# Altium schematic sheet Motor Driver.SchDoc: Motherboard-Motor Driver
size A4; Author: Patryk Bujak; DrawnBy: Patryk Bujak; DocumentNumber: 12; Revision: 1.0; SheetNumber: 6; SheetTotal: 10
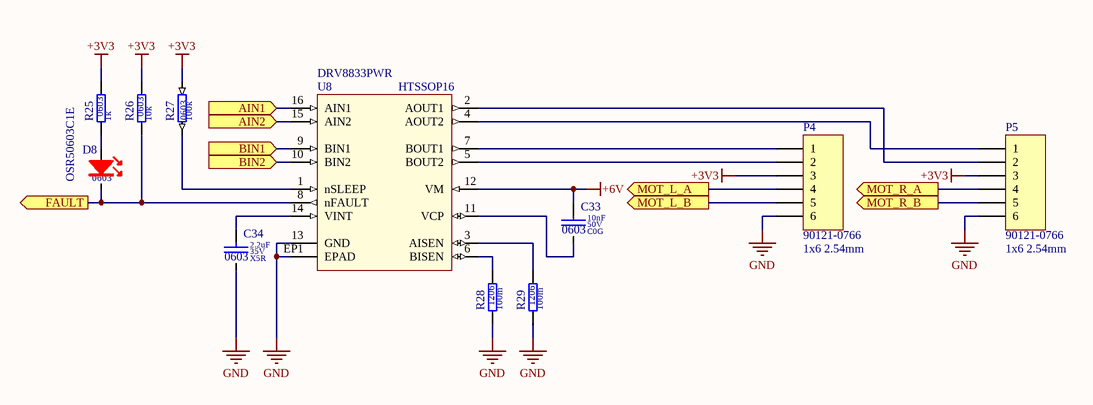
[diagram p0: Motor Driver.SchDoc]

## Parts
C33  value 10nF  Dielectric: C0G  Voltage: 50V  SCH_Footprint: 0603  [C_0603_1608]  (hidden comment: Ceramic C0G)
C34  value 2.2uF  Dielectric: X5R  Voltage: 35V  SCH_Footprint: 0603  [C_0603_1608]  (hidden comment: Ceramic X5R)
D8  value OSR50603C1E  SCH_Footprint: 0603  [OL_0603_1608]  (hidden comment: Red led)
P4  value 90121-0766  SCH_Footprint: 1x6 2.54mm  [P_HEADER_1x6_2.54_ANGLE]  (hidden comment: Goldpin)
P5  value 90121-0766  SCH_Footprint: 1x6 2.54mm  [P_HEADER_1x6_2.54_ANGLE]  (hidden comment: Goldpin)
R25  value 1k  SCH_Footprint: 0603  [R_0603_1608]  (hidden comment: Resistor)
R26  value 10k  SCH_Footprint: 0603  [R_0603_1608]  (hidden comment: Resistor)
R27  value 100k  SCH_Footprint: 0603  [R_0603_1608]  (hidden comment: Resistor)
R28  value 100m  SCH_Footprint: 1206  [R_1206_3216]  (hidden comment: Resistor)
R29  value 100m  SCH_Footprint: 1206  [R_1206_3216]  (hidden comment: Resistor)
U8  value DRV8833PWR  SCH_Footprint: HTSSOP16  [HTSSOP16_45x66x20_M]  (hidden comment: 2A Low Voltage Dual Brushed DC or Single Bipolar Stepper Motor Driver (PWM Ctrl))

## Ports
AIN1 (in), AIN2 (in), BIN1 (in), BIN2 (in), FAULT (out), MOT_L_A (out), MOT_L_B (out), MOT_R_A (out), MOT_R_B (out)

## Nets
+3V3: P4.3 P5.3 R25.2 R26.2 R27.1
+6V: C33.1 U8.12(VM)
GND: C34.2 P4.6 P5.6 R28.1 R29.1 U8.13(GND) U8.EP1(EPAD)
AIN1: U8.16(AIN1) ; port AIN1
AIN2: U8.15(AIN2) ; port AIN2
BIN1: U8.9(BIN1) ; port BIN1
BIN2: U8.10(BIN2) ; port BIN2
FAULT: D8.1(K) R26.1 U8.8(nFAULT) ; port FAULT
MOT_L_A: P4.4 ; port MOT_L_A
MOT_L_B: P4.5 ; port MOT_L_B
MOT_R_A: P5.4 ; port MOT_R_A
MOT_R_B: P5.5 ; port MOT_R_B
NetC33_2: C33.2 U8.11(VCP)
NetC34_1: C34.1 U8.14(VINT)
NetD8_2: D8.2(A) R25.1
NetP4_1: P4.1 U8.7(BOUT1)
NetP4_2: P4.2 U8.5(BOUT2)
NetP5_1: P5.1 U8.4(AOUT2)
NetP5_2: P5.2 U8.2(AOUT1)
NetR27_2: R27.2 U8.1(nSLEEP)
NetR28_2: R28.2 U8.6(BISEN)
NetR29_2: R29.2 U8.3(AISEN)

## Notes on the sheet
- Title:
- Sheet:
- of
- Author:
- Model:
- Document Number:
- Checked by:
- Iss-Rev:
- Approved by:
- Date:
- File name:

## Library data of the parts
C33 = C_10nF_50V_C0G_0603_5: Capacitor; Manufacturer: Murata; Manufacturer Part Number: GRM1885C1H103JA01D; Tolerance (%): 5; Part Number: C_10nF_50V_C0G_0603_5; HelpURL: https://datasheet.octopart.com/GRM1885C1H103JA01D-Murata-datasheet-34231350.pdf; Supplier 1: TME; Supplier Part Number 1: GRM1885C1H103JA01D; Supplier 2: RS Components; Supplier Part Number 2: 144-9032; Supplier 3: Farnell; Supplier Part Number 3: 2456107; Supplier 4: Mouser; Supplier Part Number 4: 81-GRM1885C1H103JA1D; Supplier 5: Digi-Key; Supplier Part Number 5: 490-9666-1-ND
C34 = C_2.2uF_35V_X5R_0603_10: Capacitor; Manufacturer: Murata; Manufacturer Part Number: GRM188R6YA225KA12D; Tolerance (%): 10; Part Number: C_2.2uF_35V_X5R_0603_10; HelpURL: https://datasheet.octopart.com/GRM188R6YA225KA12D-Murata-datasheet-66077095.pdf; Supplier 1: TME; Supplier 2: RS Components; Supplier Part Number 2: 8151358; Supplier 3: Farnell; Supplier Part Number 3: 2611926; Supplier 4: Mouser; Supplier Part Number 4: 81-GRM188R6YA225KA2D; Supplier 5: Digi-Key; Supplier Part Number 5: 490-7204-1-ND
D8 = OL_R_0603_OSR50603C1E: LED_RED; Manufacturer: Optosupply; Part Number: OL_R_0603_OSR50603C1E; Manufacturer Part Number: OSR50603C1E; Supplier 1: TME; Supplier Part Number 1: OSR50603C1E; Supplier 2: RS Components; Supplier 3: Farnell; Supplier 4: Mouser; Supplier 5: Digi-Key
P4 P5 = P_HEADER_1x6_2.54_ANGLE: Header, 6-Pin; Manufacturer: Molex; Part Number: P_HEADER_1x6_2.54_ANGLE; Component Type: Standard; HelpURL: https://datasheet.octopart.com/901210766-Molex-datasheet-8335778.pdf; Manufacturer Part Number: 90121-0766; Supplier 1: TME; Supplier Part Number 1: 90121-0766; Supplier 2: RS Components; Supplier Part Number 2: 3606415; Supplier 3: Farnell; Supplier Part Number 3: 9733477; Supplier 4: Mouser; Supplier Part Number 4: 538-90121-0766; Supplier 5: Digi-Key; Supplier Part Number 5: WM8112-ND
R25 = R_1k_0603_1: Manufacturer: Vishay; Manufacturer Part Number: CRCW06031K00FKEA; Voltage: 75V; Power: 100mW; Tolerance: 1%; Part Number: R_1k_0603_1; HelpURL: http://www.farnell.com/datasheets/2310790.pdf?_ga=2.256888843.1690599162.1548417389-1379097396.1542296996&_gac=1.262631934.1547230258.Cj0KCQiAmuHhBRD0ARIsAFWyPwhX8HcvXnM3tA0ZBodZLzDIjH2ZxLpjT5LWo9bad_HPRbU8LfPq44UaAhEwEALw_wcB; Supplier 1: TME; Supplier 2: RS Components; Supplier Part Number 2: 678-9875P; Supplier 3: Farnell; Supplier Part Number 3: 1469740; Supplier 4: Mouser; Supplier Part Number 4: 71-CRCW0603-1.0K-E3; Supplier 5: Digi-Key; Supplier Part Number 5: 541-1.00KHCT-ND
R26 = R_10k_0603_1: Manufacturer: Vishay; Manufacturer Part Number: CRCW060310K0FKTABC; Voltage: 75V; Power: 100mW; Tolerance: 1%; Part Number: R_10k_0603_1; HelpURL: http://www.tme.eu/pl/Document/622e28308c06d160637f2b14751ba16b/Data%20Sheet%20CRCW_BCe3.pdf; Supplier 1: TME; Supplier Part Number 1: CRCW060310K0FKTABC; Supplier 2: RS Components; Supplier 3: Farnell; Supplier 4: Mouser; Supplier Part Number 4: 667-ERJ-3EKF1002V; Supplier 5: Digi-Key; Supplier Part Number 5: P10KGCT-ND
R27 = R_100k_0603_1: Manufacturer: Royalohm; Manufacturer Part Number: 0603SAF1003T5E; Voltage: 50V; Power: 100mW; Tolerance: 1%; Part Number: R_100k_0603_1; HelpURL: http://www.tme.eu/pl/Document/b315665a56acbc42df513c99b390ad98/ROYALOHM-THICKFILM.pdf; Supplier 1: TME; Supplier Part Number 1: SMD0603-100K-1%; Supplier 2: RS Components; Supplier 3: Farnell; Supplier 4: Mouser; Supplier Part Number 4: 667-ERJ-3EKF1003V; Supplier 5: Digi-Key; Supplier Part Number 5: P100KHCT-ND
R28 R29 = R_100m_1206_1: Manufacturer: Panasonic; Manufacturer Part Number: ERJ-8BWFR100V; Voltage: 316mV; Power: 1W; Tolerance: 1%; Part Number: R_100m_1206_1; HelpURL: https://docs-emea.rs-online.com/webdocs/154c/0900766b8154cd36.pdf; Supplier 1: TME; Supplier 2: RS Components; Supplier Part Number 2: 566-058; Supplier 3: Farnell; Supplier Part Number 3: 1577547; Supplier 4: Mouser; Supplier Part Number 4: 667-ERJ-8BWFR100V; Supplier 5: Digi-Key; Supplier Part Number 5: P.10AUDKR-ND
U8 = U_DRV8833PWR: Manufacturer: Texas Instruments; Part Number: U_DRV8833PWR; HelpURL: http://www.ti.com/lit/ds/symlink/drv8833.pdf; Manufacturer Part Number: DRV8833PWR; Supplier 1: TME; Supplier 2: RS Components; Supplier 3: Farnell; Supplier 4: Mouser; Supplier Part Number 4: 595-DRV8833PWR; Supplier 5: Digi-Key; Supplier Part Number 5: 296-40080-1-ND